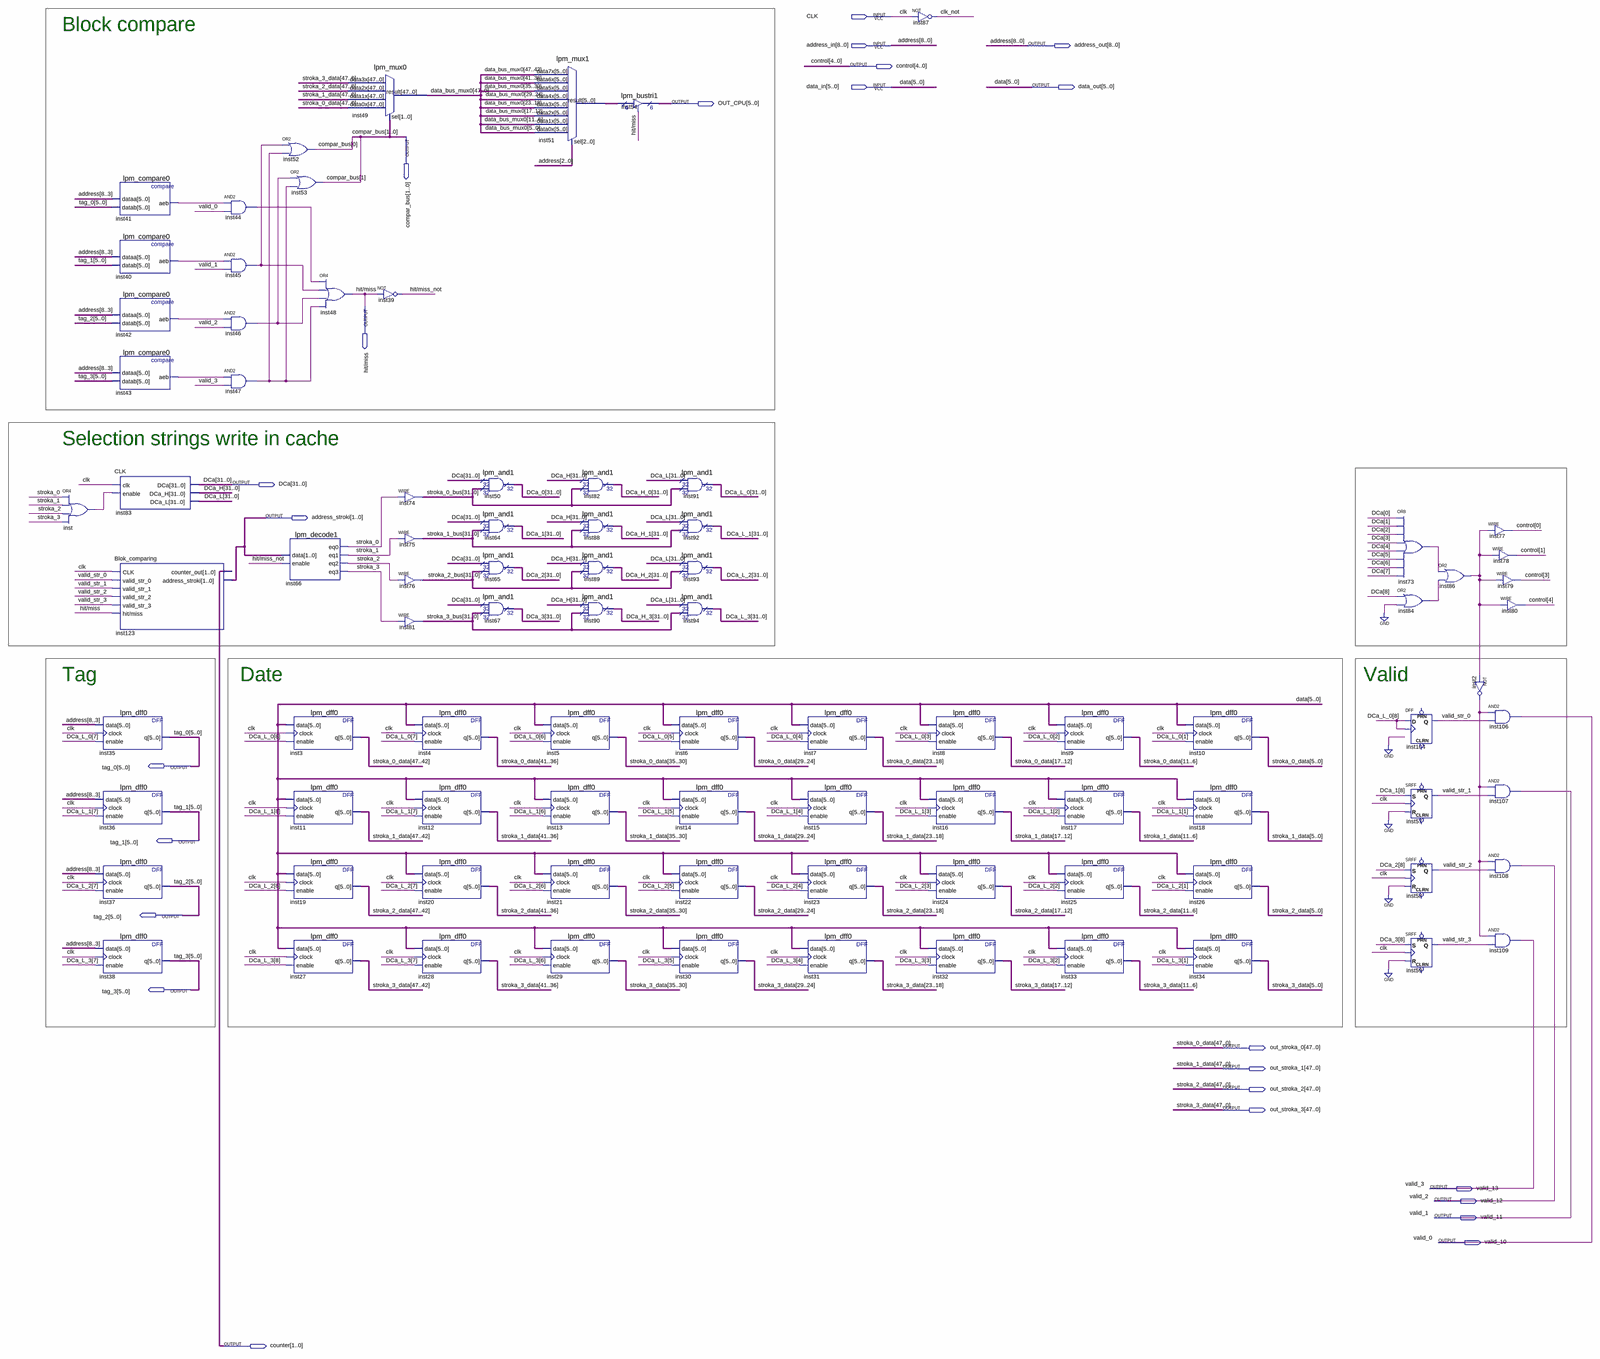
[diagram p0: schematic sheet, whole]
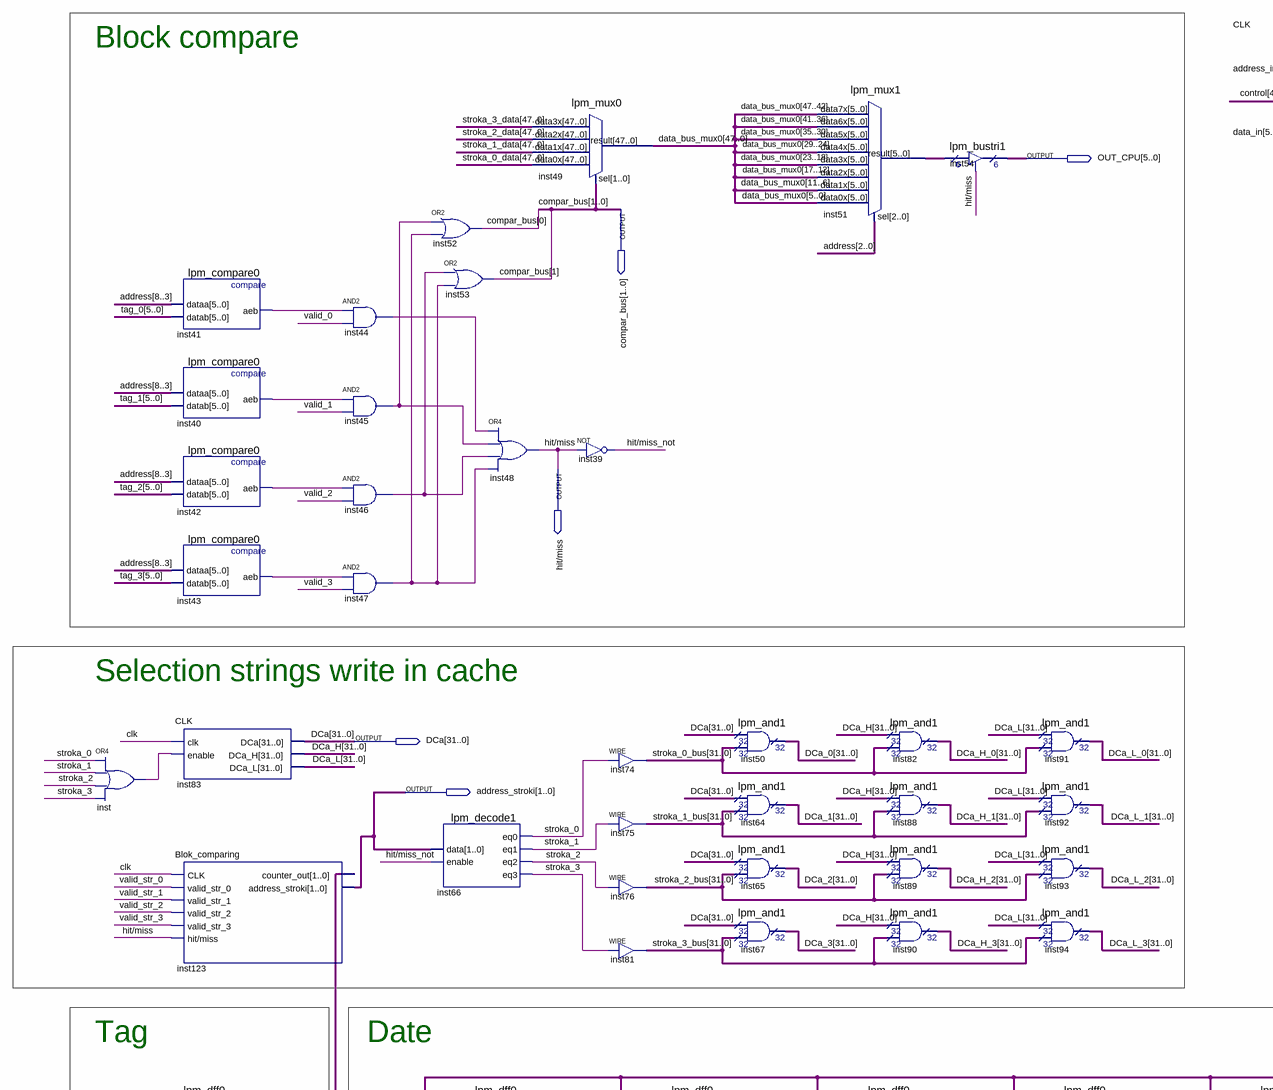
[diagram p1: schematic sheet, upper left part]
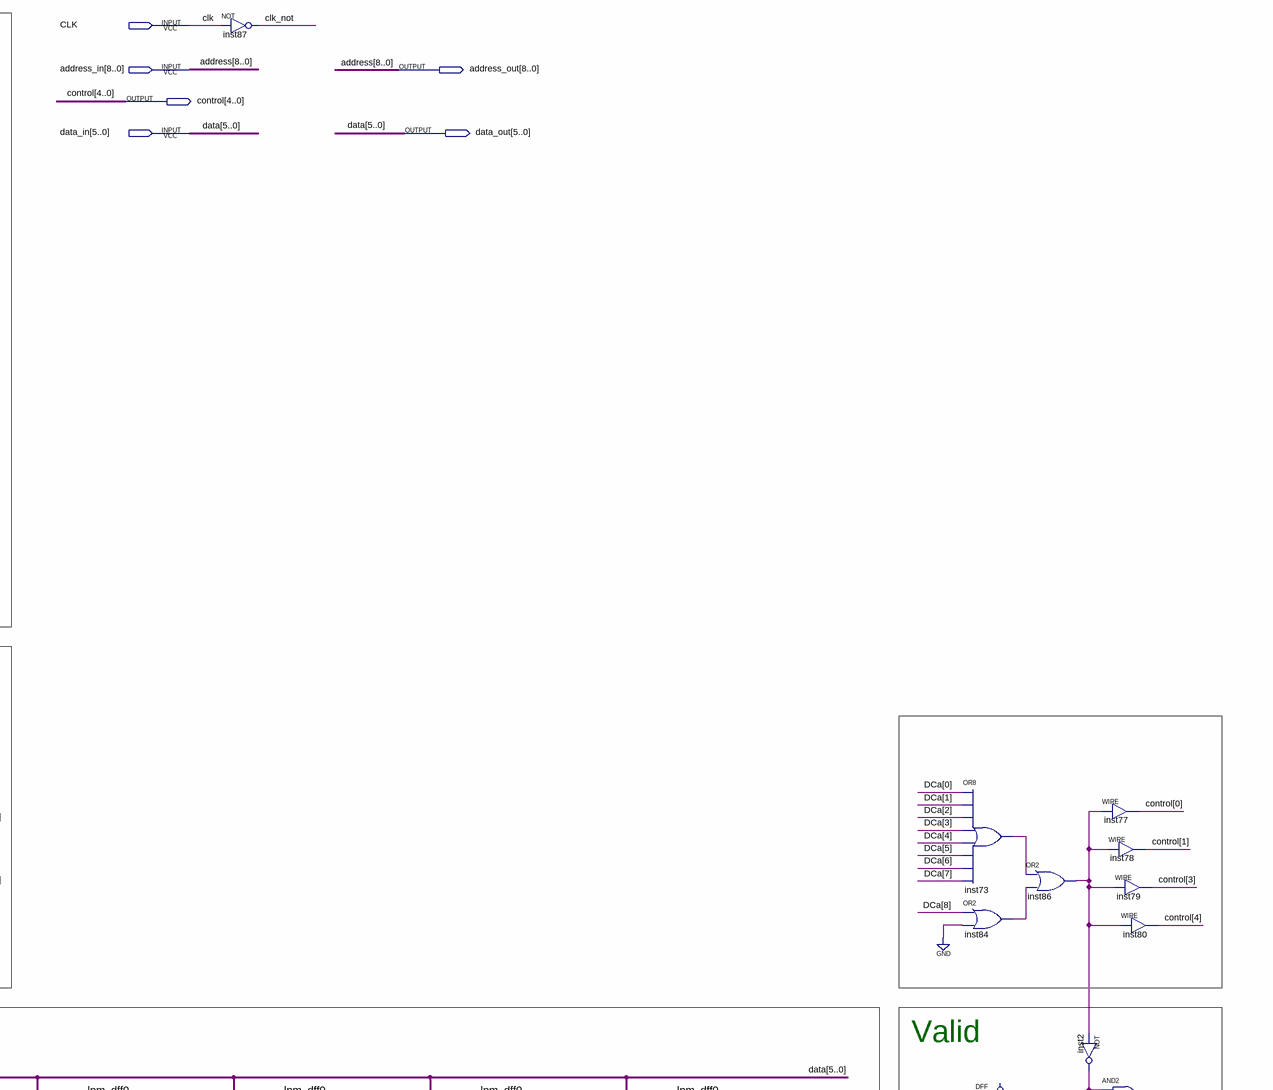
[diagram p2: schematic sheet, upper right part]
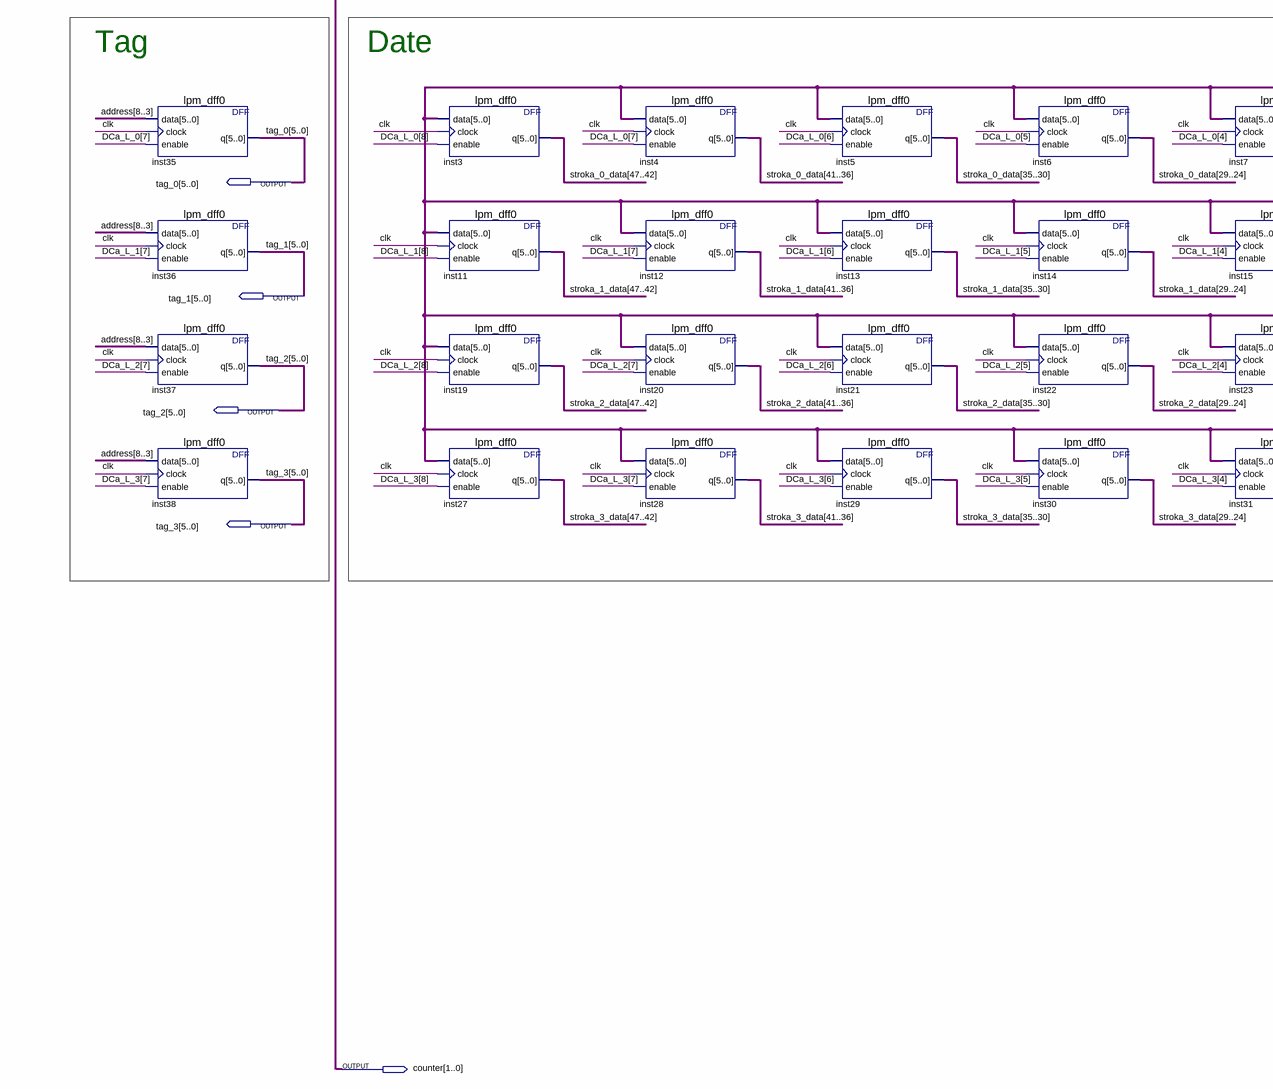
[diagram p3: schematic sheet, lower left part]
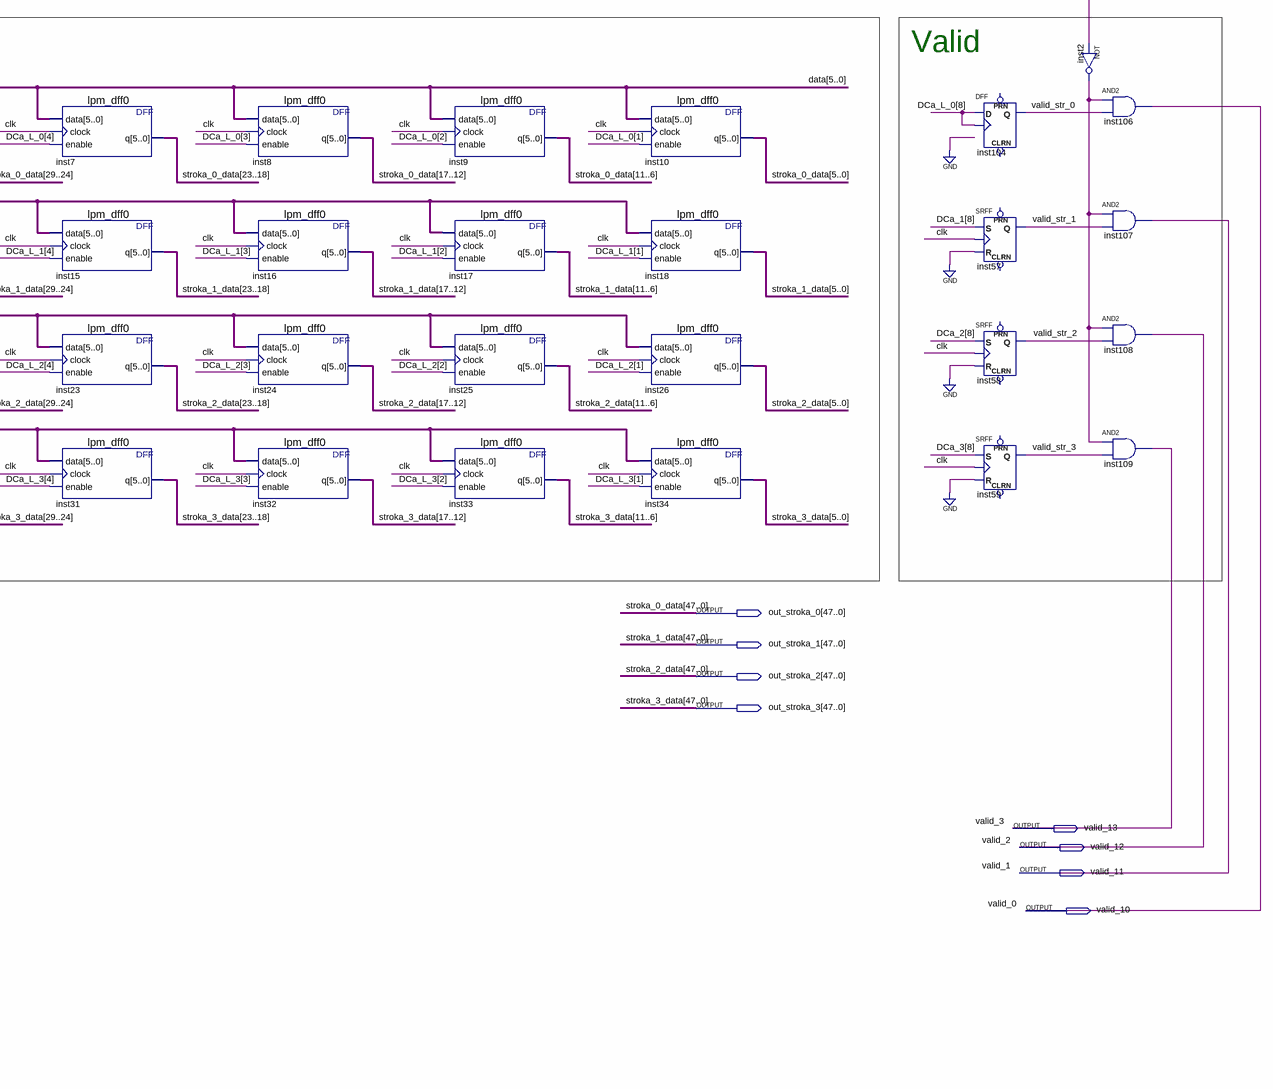
[diagram p4: schematic sheet, lower right part]
// Quartus schematic Control_device_cache.bdf as structural Verilog: 88 symbols, 24 pins
module Control_device_cache (
  input  CLK,
  input  [8:0] address_in,
  input  [5:0] data_in,
  output [8:0] address_out,
  output [4:0] control,
  output [5:0] data_out,
  output [5:0] OUT_CPU,
  output [1:0] compar_bus,
  output \hit/miss ,
  output [31:0] DCa,
  output [1:0] address_stroki,
  output [5:0] tag_0,
  output [5:0] tag_1,
  output [5:0] tag_2,
  output [5:0] tag_3,
  output [47:0] out_stroka_0,
  output [47:0] out_stroka_1,
  output [47:0] out_stroka_2,
  output [47:0] out_stroka_3,
  output valid_13,
  output valid_12,
  output valid_11,
  output valid_10,
  output [1:0] counter
);

  wire clk_not, \hit/miss_not , inst2_out, inst40_aeb, inst41_aeb, inst42_aeb, inst43_aeb, inst44_out,
       inst45_out, inst46_out, inst47_out, inst73_out, inst84_out, inst86_out, inst_out, stroka_0, stroka_1,
       stroka_2, stroka_3, valid_str_0, valid_str_1, valid_str_2, valid_str_3;
  wire [5:0] inst51_result;
  wire [31:0] DCa_0, DCa_1, DCa_2, DCa_3, DCa_H, DCa_H_0, DCa_H_1, DCa_H_2, DCa_H_3, DCa_L, DCa_L_0, DCa_L_1,
       DCa_L_2, DCa_L_3, stroka_0_bus, stroka_1_bus, stroka_2_bus, stroka_3_bus;
  wire [47:0] data_bus_mux0;

  or inst (inst_out, stroka_0, stroka_1, stroka_2, stroka_3);
  lpm_compare0 inst41 (.dataa(address_in[8:3]), .datab(tag_0), .aeb(inst41_aeb));
  lpm_compare0 inst40 (.dataa(address_in[8:3]), .datab(tag_1), .aeb(inst40_aeb));
  lpm_compare0 inst42 (.dataa(address_in[8:3]), .datab(tag_2), .aeb(inst42_aeb));
  lpm_compare0 inst43 (.dataa(address_in[8:3]), .datab(tag_3), .aeb(inst43_aeb));
  CLK inst83 (.clk(CLK), .enable(inst_out), .DCa(DCa), .DCa_H(DCa_H), .DCa_L(DCa_L));
  Blok_comparing inst123 (
    .CLK(CLK), .valid_str_0(valid_str_0), .valid_str_1(valid_str_1), .valid_str_2(valid_str_2),
    .valid_str_3(valid_str_3), .\hit/miss (\hit/miss ), .counter_out(counter), .address_stroki(address_stroki));
  lpm_dff0 inst35 (.data(address_in[8:3]), .clock(CLK), .enable(DCa_L_0[7]), .q(tag_0));
  lpm_dff0 inst36 (.data(address_in[8:3]), .clock(CLK), .enable(DCa_L_1[7]), .q(tag_1));
  lpm_dff0 inst37 (.data(address_in[8:3]), .clock(CLK), .enable(DCa_L_2[7]), .q(tag_2));
  lpm_dff0 inst38 (.data(address_in[8:3]), .clock(CLK), .enable(DCa_L_3[7]), .q(tag_3));
  and inst44 (inst44_out, inst41_aeb, valid_10);
  and inst45 (inst45_out, inst40_aeb, valid_11);
  and inst46 (inst46_out, inst42_aeb, valid_12);
  and inst47 (inst47_out, inst43_aeb, valid_13);
  or inst52 (compar_bus[0], inst45_out, inst47_out);
  lpm_decode1 inst66 (
    .data(address_stroki), .enable(\hit/miss_not ), .eq0(stroka_0), .eq1(stroka_1), .eq2(stroka_2),
    .eq3(stroka_3));
  or inst53 (compar_bus[1], inst46_out, inst47_out);
  lpm_dff0 inst3 (.data(data_in), .clock(CLK), .enable(DCa_L_0[8]), .q(out_stroka_0[47:42]));
  lpm_dff0 inst11 (.data(data_in), .clock(CLK), .enable(DCa_L_1[8]), .q(out_stroka_1[47:42]));
  lpm_dff0 inst19 (.data(data_in), .clock(CLK), .enable(DCa_L_2[8]), .q(out_stroka_2[47:42]));
  lpm_dff0 inst27 (.data(data_in), .clock(CLK), .enable(DCa_L_3[8]), .q(out_stroka_3[47:42]));
  lpm_mux0 inst49 (
    .data3x(out_stroka_3), .data2x(out_stroka_2), .data1x(out_stroka_1), .data0x(out_stroka_0),
    .sel(compar_bus), .result(data_bus_mux0));
  or inst48 (\hit/miss , inst44_out, inst45_out, inst46_out, inst47_out);
  not inst39 (\hit/miss_not , \hit/miss );
  assign stroka_0_bus = {32{stroka_0}};  // WIRE inst74
  assign stroka_1_bus = {32{stroka_1}};  // WIRE inst75
  assign stroka_2_bus = {32{stroka_2}};  // WIRE inst76
  assign stroka_3_bus = {32{stroka_3}};  // WIRE inst81
  lpm_dff0 inst4 (.data(data_in), .clock(CLK), .enable(DCa_L_0[7]), .q(out_stroka_0[41:36]));
  lpm_dff0 inst12 (.data(data_in), .clock(CLK), .enable(DCa_L_1[7]), .q(out_stroka_1[41:36]));
  lpm_dff0 inst20 (.data(data_in), .clock(CLK), .enable(DCa_L_2[7]), .q(out_stroka_2[41:36]));
  lpm_dff0 inst28 (.data(data_in), .clock(CLK), .enable(DCa_L_3[7]), .q(out_stroka_3[41:36]));
  lpm_and1 inst50 (.data0x(DCa), .data1x(stroka_0_bus), .result(DCa_0));
  lpm_and1 inst64 (.data0x(DCa), .data1x(stroka_1_bus), .result(DCa_1));
  lpm_and1 inst65 (.data0x(DCa), .data1x(stroka_2_bus), .result(DCa_2));
  lpm_and1 inst67 (.data0x(DCa), .data1x(stroka_3_bus), .result(DCa_3));
  lpm_mux1 inst51 (
    .data7x(data_bus_mux0[47:42]), .data6x(data_bus_mux0[41:36]), .data5x(data_bus_mux0[35:30]),
    .data4x(data_bus_mux0[29:24]), .data3x(data_bus_mux0[23:18]), .data2x(data_bus_mux0[17:12]),
    .data1x(data_bus_mux0[11:6]), .data0x(data_bus_mux0[5:0]), .sel(address_in[2:0]), .result(inst51_result));
  lpm_dff0 inst5 (.data(data_in), .clock(CLK), .enable(DCa_L_0[6]), .q(out_stroka_0[35:30]));
  lpm_dff0 inst13 (.data(data_in), .clock(CLK), .enable(DCa_L_1[6]), .q(out_stroka_1[35:30]));
  lpm_dff0 inst21 (.data(data_in), .clock(CLK), .enable(DCa_L_2[6]), .q(out_stroka_2[35:30]));
  lpm_dff0 inst29 (.data(data_in), .clock(CLK), .enable(DCa_L_3[6]), .q(out_stroka_3[35:30]));
  lpm_and1 inst82 (.data0x(DCa_H), .data1x(stroka_0_bus), .result(DCa_H_0));
  lpm_and1 inst88 (.data0x(DCa_H), .data1x(stroka_1_bus), .result(DCa_H_1));
  lpm_and1 inst89 (.data0x(DCa_H), .data1x(stroka_2_bus), .result(DCa_H_2));
  lpm_and1 inst90 (.data0x(DCa_H), .data1x(stroka_3_bus), .result(DCa_H_3));
  lpm_bustri1 inst54 (.enabledt(\hit/miss ), .data(inst51_result), .tridata(OUT_CPU));
  lpm_and1 inst91 (.data0x(DCa_L), .data1x(stroka_0_bus), .result(DCa_L_0));
  lpm_and1 inst92 (.data0x(DCa_L), .data1x(stroka_1_bus), .result(DCa_L_1));
  lpm_and1 inst93 (.data0x(DCa_L), .data1x(stroka_2_bus), .result(DCa_L_2));
  lpm_and1 inst94 (.data0x(DCa_L), .data1x(stroka_3_bus), .result(DCa_L_3));
  lpm_dff0 inst6 (.data(data_in), .clock(CLK), .enable(DCa_L_0[5]), .q(out_stroka_0[29:24]));
  lpm_dff0 inst14 (.data(data_in), .clock(CLK), .enable(DCa_L_1[5]), .q(out_stroka_1[29:24]));
  lpm_dff0 inst22 (.data(data_in), .clock(CLK), .enable(DCa_L_2[5]), .q(out_stroka_2[29:24]));
  lpm_dff0 inst30 (.data(data_in), .clock(CLK), .enable(DCa_L_3[5]), .q(out_stroka_3[29:24]));
  lpm_dff0 inst7 (.data(data_in), .clock(CLK), .enable(DCa_L_0[4]), .q(out_stroka_0[23:18]));
  lpm_dff0 inst15 (.data(data_in), .clock(CLK), .enable(DCa_L_1[4]), .q(out_stroka_1[23:18]));
  lpm_dff0 inst23 (.data(data_in), .clock(CLK), .enable(DCa_L_2[4]), .q(out_stroka_2[23:18]));
  lpm_dff0 inst31 (.data(data_in), .clock(CLK), .enable(DCa_L_3[4]), .q(out_stroka_3[23:18]));
  not inst87 (clk_not, CLK);
  lpm_dff0 inst8 (.data(data_in), .clock(CLK), .enable(DCa_L_0[3]), .q(out_stroka_0[17:12]));
  lpm_dff0 inst16 (.data(data_in), .clock(CLK), .enable(DCa_L_1[3]), .q(out_stroka_1[17:12]));
  lpm_dff0 inst24 (.data(data_in), .clock(CLK), .enable(DCa_L_2[3]), .q(out_stroka_2[17:12]));
  lpm_dff0 inst32 (.data(data_in), .clock(CLK), .enable(DCa_L_3[3]), .q(out_stroka_3[17:12]));
  lpm_dff0 inst9 (.data(data_in), .clock(CLK), .enable(DCa_L_0[2]), .q(out_stroka_0[11:6]));
  lpm_dff0 inst17 (.data(data_in), .clock(CLK), .enable(DCa_L_1[2]), .q(out_stroka_1[11:6]));
  lpm_dff0 inst25 (.data(data_in), .clock(CLK), .enable(DCa_L_2[2]), .q(out_stroka_2[11:6]));
  lpm_dff0 inst33 (.data(data_in), .clock(CLK), .enable(DCa_L_3[2]), .q(out_stroka_3[11:6]));
  lpm_dff0 inst10 (.data(data_in), .clock(CLK), .enable(DCa_L_0[1]), .q(out_stroka_0[5:0]));
  lpm_dff0 inst18 (.data(data_in), .clock(CLK), .enable(DCa_L_1[1]), .q(out_stroka_1[5:0]));
  lpm_dff0 inst26 (.data(data_in), .clock(CLK), .enable(DCa_L_2[1]), .q(out_stroka_2[5:0]));
  lpm_dff0 inst34 (.data(data_in), .clock(CLK), .enable(DCa_L_3[1]), .q(out_stroka_3[5:0]));
  or inst73 (inst73_out, DCa[0], DCa[1], DCa[2], DCa[3], DCa[4], DCa[5], DCa[6], DCa[7]);
  or inst84 (inst84_out, DCa[8], 1'b0);
  DFF inst104 (.CLK(DCa_L_0[8]), .D(DCa_L_0[8]), .Q(valid_str_0));  // open: CLRN, PRN
  SRFF inst57 (.S(DCa_1[8]), .R(1'b0), .CLK(CLK), .Q(valid_str_1));  // open: PRN, CLRN
  SRFF inst58 (.S(DCa_2[8]), .R(1'b0), .CLK(CLK), .Q(valid_str_2));  // open: PRN, CLRN
  SRFF inst59 (.S(DCa_3[8]), .R(1'b0), .CLK(CLK), .Q(valid_str_3));  // open: PRN, CLRN
  or inst86 (inst86_out, inst73_out, inst84_out);
  not inst2 (inst2_out, inst86_out);
  assign control[0] = inst86_out;  // WIRE inst77
  assign control[1] = inst86_out;  // WIRE inst78
  assign control[3] = inst86_out;  // WIRE inst79
  assign control[4] = inst86_out;  // WIRE inst80
  and inst106 (valid_10, inst2_out, valid_str_0);
  and inst107 (valid_11, inst2_out, valid_str_1);
  and inst108 (valid_12, inst2_out, valid_str_2);
  and inst109 (valid_13, inst2_out, valid_str_3);

  assign address_out = address_in;
  assign data_out = data_in;

  // Other names for the same wires on the sheet: address[8:0] = address_in; data[5:0] = data_in;
  //   stroka_0_data[47:0] = out_stroka_0; stroka_1_data[47:0] = out_stroka_1; stroka_2_data[47:0] = out_stroka_2;
  //   stroka_3_data[47:0] = out_stroka_3; valid_0 = valid_10; valid_1 = valid_11; valid_2 = valid_12;
  //   valid_3 = valid_13

  // Notes on the sheet:
  //   Block compare
  //   Selection strings write in cache
  //   Tag
  //   Date
  //   Valid
endmodule
